# Altium schematic sheet DC_MTR_DVR_SCHEM.SchDoc: DUAL DC MOTOR DRIVER
size A4; Date: 01/08/2024; Author: R Abhram; SheetNumber: 1; SheetTotal: 1
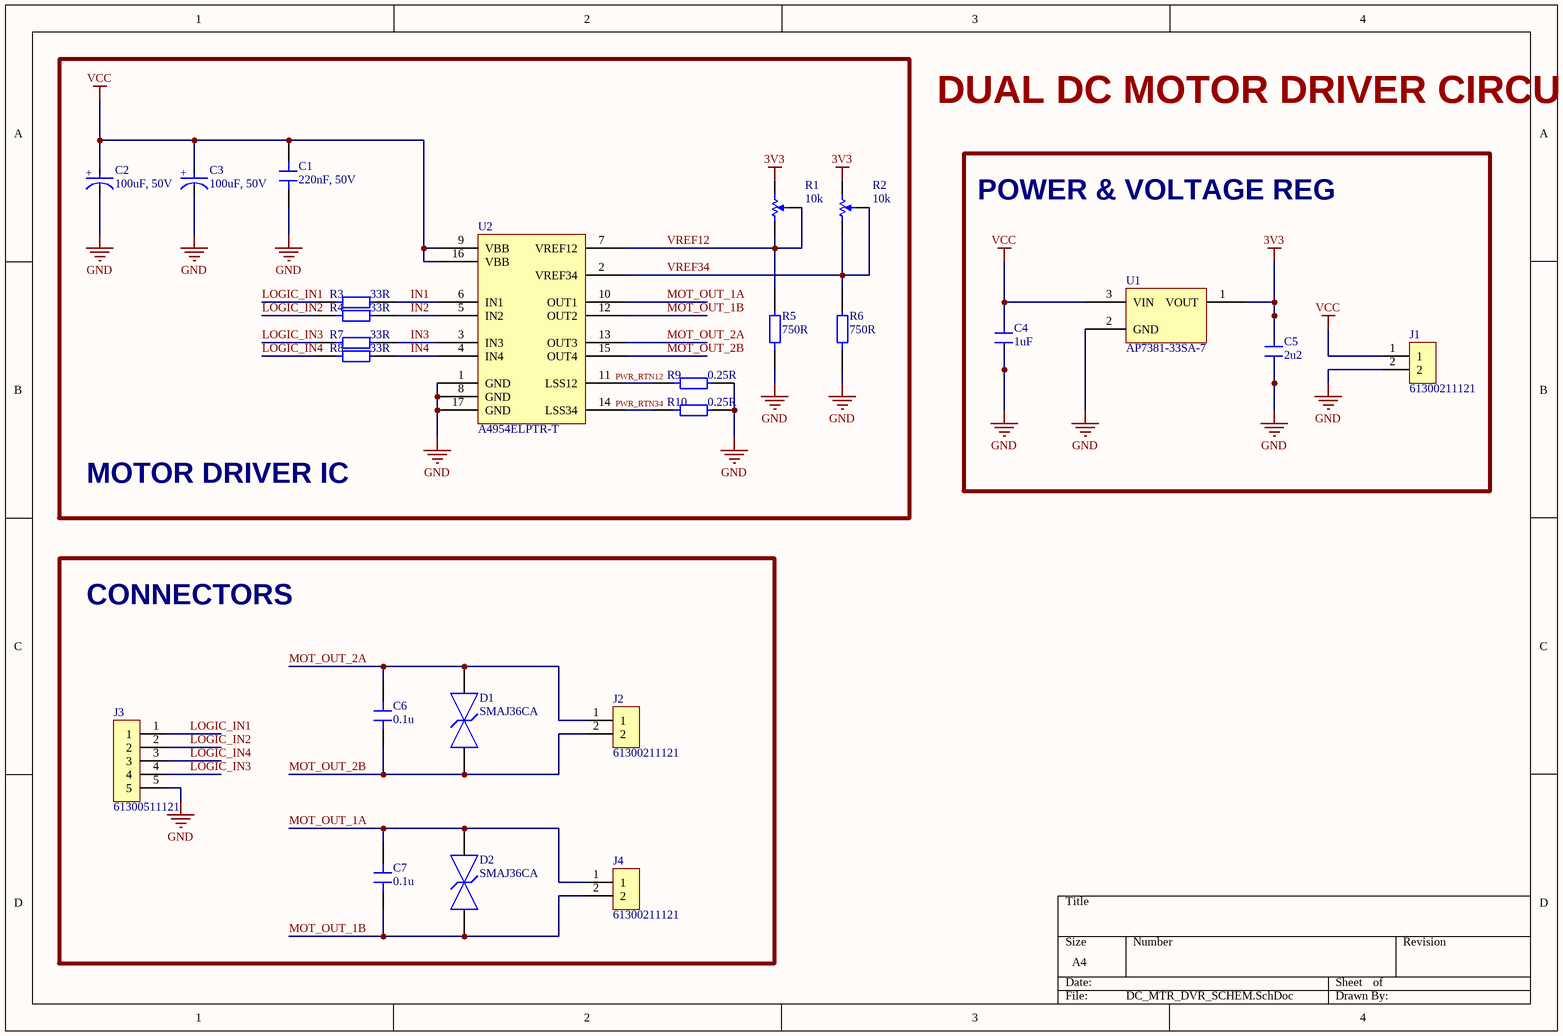
[diagram p0: DC_MTR_DVR_SCHEM.SchDoc]

## Parts
C1  220nF, 50V  [FP-0402-L_1_0_0_05-W_0_5-IPC_A]
C2  100uF, 50V  [100U_50V_ELECTROLYTIC_CAP]
C3  100uF, 50V  [100U_50V_ELECTROLYTIC_CAP]
C4  1uF  [1U_0402_CER_CAP_35V]
C5  2u2  [2_2U_0402_CER_CAP]
C6  0.1u  [1U_0402_CER_CAP_35V]
C7  0.1u  [1U_0402_CER_CAP_35V]
D1  SMAJ36CA  [TVS_DIODE]
D2  SMAJ36CA  [TVS_DIODE]
J1  61300211121  [2_POS_HEADER_2_54]
J2  61300211121  [2_POS_HEADER_2_54]
J3  61300511121  [5_POS_HEADER_2_54]
J4  61300211121  [2_POS_HEADER_2_54]
R1  10k  [10K_TRIM_POT]
R2  10k  [10K_TRIM_POT]
R3  33R  [33_0402_RES]
R4  33R  [33_0402_RES]
R5  750R  [750_0402_RES]
R6  750R  [750_0402_RES]
R7  33R  [33_0402_RES]
R8  33R  [33_0402_RES]
R9  0.25R  [0_25_RESISTOR]
R10  0.25R  [0_25_RESISTOR]
U1  AP7381-33SA-7  [DIODES INC SOT-89 LINEAR REG]
U2  A4954ELPTR-T  [ALLEGRO TSSOP-16EP LP]

## Blocks framed on the sheet
MOTOR DRIVER IC: C1-C3 R1-R10 U2
POWER & VOLTAGE REG: C4 C5 J1 U1
CONNECTORS: C6 C7 D1 D2 J2-J4

## Nets
3V3: C5.2 R1.3 R2.3 U1.1(VOUT)
GND: C1.1 C2.1(C) C3.1(C) C4.1 C5.1 J1.2 J3.5 R5.1 R6.1 R9.2 R10.2 U1.2(GND) U2.1(GND) U2.8(GND) U2.17(GND)
VCC: C1.2 C2.2(A) C3.2(A) C4.2 J1.1 U1.3(VIN) U2.9(VBB) U2.16(VBB)
IN1: R3.2 U2.6(IN1)
IN2: R4.2 U2.5(IN2)
IN3: R7.2 U2.3(IN3)
IN4: R8.2 U2.4(IN4)
LOGIC_IN1: J3.1 R3.1
LOGIC_IN2: J3.2 R4.1
LOGIC_IN3: J3.4 R7.1
LOGIC_IN4: J3.3 R8.1
MOT_OUT_1A: C7.2 D2.2 J4.1 U2.10(OUT1)
MOT_OUT_1B: C7.1 D2.1 J4.2 U2.12(OUT2)
MOT_OUT_2A: C6.2 D1.2 J2.1 U2.13(OUT3)
MOT_OUT_2B: C6.1 D1.1 J2.2 U2.15(OUT4)
PWR_RTN12: R9.1 U2.11(LSS12)
PWR_RTN34: R10.1 U2.14(LSS34)
VREF12: R1.1 R1.2 R5.2 U2.7(VREF12)
VREF34: R2.1 R2.2 R6.2 U2.2(VREF34)

## Notes on the sheet
- DUAL DC MOTOR DRIVER CIRCUIT
- (in symbol UWT1H101MNL1GS) +

## Library data of the parts
C1 = UMK105BJ224KV-F: CAP CER 0.22UF 50V X5R 0402; Manufacturer: Taiyo Yuden; Material: 4241ConductorMaterial; Tolerance: 10%; Supplier: Avnet; Supplier Part Number: UMK105BJ224KV-F; Manufacturer Part Number: UMK105BJ224KV-F; RoHS: Yes; Category: Ceramic Capacitors; Stock: 170000; Pricing: 10000=0.03115, 20000=0.03045, 40000=0.02905, 60000=0.02398, 80000=0.02338 (USD); Mounting Technology: Surface Mount; Case/Package: 0402; Case Code (Metric): 1005; Case Code (Imperial): 0402; Min Operating Temperature: -55°C; Max Operating Temperature: 85°C; Package Quantity: 1; Packaging: Tape and Reel; Value: 220nF; Voltage Rating: 50V; Voltage Rating (DC): 50V; Dielectric: X5R; Termination: SMD/SMT; Series: M; Length: 0.039inch; Width: 0.02inch; Height: 0.5mm; Thickness: 0.022inch; RoHS Compliant: Yes; Halogen Free: 5694HalogenFree; Lead Free: 5697LeadFree; ComponentLink1URL: https://datasheet.ciiva.com/24495/460umk105bj224kv-f-24495779.pdf?src-supplier=Onlinecomponents.com; ComponentLink1Description: https://datasheet.ciiva.com/24495/460umk105bj224kv-f-24495779.pdf?src-supplier=Onlinecomponents.com; ComponentLink2URL: https://datasheet.ciiva.com/30112/713umk105bj224kv-f-30112478.pdf?src-supplier=Onlinecomponents.com; ComponentLink2Description: https://datasheet.ciiva.com/30112/713umk105bj224kv-f-30112478.pdf?src-supplier=Onlinecomponents.com; ComponentLink3URL: https://datasheet.ciiva.com/18697/mlcc-all-e-18697509.pdf?src-supplier=Digikey; ComponentLink3Description: https://datasheet.ciiva.com/18697/mlcc-all-e-18697509.pdf?src-supplier=Digikey; LCSC Part No.: C268018
C2 C3 = UWT1H101MNL1GS: CAP ALUM 100UF 20% 50V SMD; Manufacturer: Nichicon; Dielectric Material: 158ConductorMaterial; Polarity: 5066Direction; Supplier: Rs; Supplier Part Number: 7392870P; Manufacturer Part Number: UWT1H101MNL1GS; RoHS: Yes; Category: Aluminum Electrolytic Capacitors; Stock: 280; Pricing: 250=0.114, 1000=0.111 (GBP); Lead Free: 5697LeadFree; ComponentLink1URL: https://datasheet.ciiva.com/11776/0900766b80fa3a91-11776930.pdf?src-supplier=Rs; ComponentLink1Description: https://datasheet.ciiva.com/11776/0900766b80fa3a91-11776930.pdf?src-supplier=Rs; ComponentLink2URL: https://datasheet.ciiva.com/97/e-wt-97104.pdf?src-supplier=Digikey; ComponentLink2Description: https://datasheet.ciiva.com/97/e-wt-97104.pdf?src-supplier=Digikey; ComponentLink3URL: https://datasheet.ciiva.com/97/e-wt-97105.pdf?src-supplier=Digikey; ComponentLink3Description: https://datasheet.ciiva.com/97/e-wt-97105.pdf?src-supplier=Digikey; ComponentLink4URL: https://datasheet.ciiva.com/97/e-wt-97106.pdf?src-supplier=Digikey; ComponentLink4Description: https://datasheet.ciiva.com/97/e-wt-97106.pdf?src-supplier=Digikey; ComponentLink5URL: https://datasheet.ciiva.com/5362/e-wt-30307-5362773.pdf?src-supplier=Mouser; ComponentLink5Description: https://datasheet.ciiva.com/5362/e-wt-30307-5362773.pdf?src-supplier=Mouser; ComponentLink6URL: https://datasheet.ciiva.com/28458/1910938-28458459.pdf?src-supplier=Element14; ComponentLink6Description: https://datasheet.ciiva.com/28458/1910938-28458459.pdf?src-supplier=Element14; ComponentLink7URL: https://datasheet.ciiva.com/7781/e-wt-7781807.pdf?src-supplier=Element14; ComponentLink7Description: https://datasheet.ciiva.com/7781/e-wt-7781807.pdf?src-supplier=Element14; ComponentLink8URL: https://datasheet.ciiva.com/11686/e-wt-11686889.pdf?src-supplier=Avnet; ComponentLink8Description: https://datasheet.ciiva.com/11686/e-wt-11686889.pdf?src-supplier=Avnet; ComponentLink9URL: https://datasheet.ciiva.com/16502/e-wt-16502940.pdf?src-supplier=Future+Electronics; ComponentLink9Description: https://datasheet.ciiva.com/16502/e-wt-16502940.pdf?src-supplier=Future+Electronics; LCSC Part No.: C445063
C4 = C1005X5R1V105K050BC: 1 µF ±10% 35V Ceramic Capacitor X5R 0402 (1005 Metric); Manufacturer: TDK; Material: 4241ConductorMaterial; Supplier: Digikey; Supplier Part Number: 445-9073-1-ND; Manufacturer Part Number: C1005X5R1V105K050BC; RoHS: Yes; Category: Ceramic Capacitors; Stock: 841637; Pricing: 1=0.18, 10=0.122, 50=0.0728, 100=0.0573, 500=0.04234, 1000=0.03506, 2500=0.03263, 5000=0.02985 (USD); Mounting Technology: Surface Mount; Case/Package: 0402; Case Code (Metric): 1005; Case Code (Imperial): 0402; Dielectric Material: Ceramic; Min Operating Temperature: -55°C; Max Operating Temperature: 85°C; Tolerance: 10%; Value: 1uF; Voltage Rating: 35V; Packaging: Tape and Reel; Series: C; Dielectric: X5R; Length: 1mm; Depth: 0.5mm; Radiation Hardening: No; Reach SVHC Compliant: No; Lead Free: Lead Free; RoHS Compliant: Yes; ComponentLink1URL: https://datasheet.ciiva.com/26834/getdatasheetpartid-750449-26834298.pdf?src-supplier=Verical; ComponentLink1Description: https://datasheet.ciiva.com/26834/getdatasheetpartid-750449-26834298.pdf?src-supplier=Verical; ComponentLink2URL: https://datasheet.ciiva.com/28451/1796654-28451087.pdf?src-supplier=Element14; ComponentLink2Description: https://datasheet.ciiva.com/28451/1796654-28451087.pdf?src-supplier=Element14; ComponentLink3URL: https://datasheet.ciiva.com/22719/1796654-22719533.pdf?src-supplier=Element14; ComponentLink3Description: https://datasheet.ciiva.com/22719/1796654-22719533.pdf?src-supplier=Element14; LCSC Part No.: C5331012
C5 = GRM188R6YA225KA12D: CAP CER 2.2UF 35V X5R 0603; Manufacturer: Murata; Supplier: Digikey; Supplier Part Number: 490-7204-1-ND; Manufacturer Part Number: GRM188R6YA225KA12D; RoHS: Yes; Category: Ceramic Capacitors; Stock: 373912; Pricing: 1=0.19, 10=0.131, 50=0.0786, 100=0.0618, 500=0.04562, 1000=0.03776 (USD); Lead Free: 5697LeadFree; ComponentLink1URL: https://datasheet.ciiva.com/14906/partnumbering-e-01-14906490.pdf?src-supplier=Digikey; ComponentLink1Description: https://datasheet.ciiva.com/14906/partnumbering-e-01-14906490.pdf?src-supplier=Digikey; ComponentLink2URL: https://datasheet.ciiva.com/14906/partnumbering-e-01-14906491.pdf?src-supplier=Digikey; ComponentLink2Description: https://datasheet.ciiva.com/14906/partnumbering-e-01-14906491.pdf?src-supplier=Digikey; ComponentLink3URL: https://datasheet.ciiva.com/14906/partnumbering-e-01-14906492.pdf?src-supplier=Digikey; ComponentLink3Description: https://datasheet.ciiva.com/14906/partnumbering-e-01-14906492.pdf?src-supplier=Digikey; LCSC Part No.: C86017
C6 C7 = GMK105BJ104KV-F: CAP CER 0.1UF 35V X5R 0402; Manufacturer: Taiyo Yuden; Material: 4241ConductorMaterial; Supplier: Digikey; Supplier Part Number: 587-1994-6-ND; Manufacturer Part Number: GMK105BJ104KV-F; RoHS: Yes; Category: Ceramic Capacitors; Stock: 1172174; Pricing: 1=0.13, 10=0.089, 50=0.053, 100=0.0417, 500=0.0308, 1000=0.0255, 2500=0.02374, 5000=0.02172 (USD); Halogen Free: 5694HalogenFree; ComponentLink1URL: https://datasheet.ciiva.com/30194/200gmk105bj104kv-f-30194761.pdf?src-supplier=Onlinecomponents.com; ComponentLink1Description: https://datasheet.ciiva.com/30194/200gmk105bj104kv-f-30194761.pdf?src-supplier=Onlinecomponents.com; ComponentLink2URL: https://datasheet.ciiva.com/11464/gmk105bj104kv-f-ss-11464131.pdf?src-supplier=Avnet; ComponentLink2Description: https://datasheet.ciiva.com/11464/gmk105bj104kv-f-ss-11464131.pdf?src-supplier=Avnet; ComponentLink3URL: https://datasheet.ciiva.com/30104/147gmk105bj104kv-f-30104963.pdf?src-supplier=Onlinecomponents.com; ComponentLink3Description: https://datasheet.ciiva.com/30104/147gmk105bj104kv-f-30104963.pdf?src-supplier=Onlinecomponents.com; ComponentLink4URL: https://datasheet.ciiva.com/15920/1013gmk105bj104kv-f-15920676.pdf?src-supplier=Onlinecomponents.com; ComponentLink4Description: https://datasheet.ciiva.com/15920/1013gmk105bj104kv-f-15920676.pdf?src-supplier=Onlinecomponents.com; ComponentLink5URL: https://datasheet.ciiva.com/5412/mlcc-all-e-541559-5412764.pdf?src-supplier=Mouser; ComponentLink5Description: https://datasheet.ciiva.com/5412/mlcc-all-e-541559-5412764.pdf?src-supplier=Mouser; ComponentLink6URL: https://datasheet.ciiva.com/7657/1497285-7657325.pdf?src-supplier=Element14; ComponentLink6Description: https://datasheet.ciiva.com/7657/1497285-7657325.pdf?src-supplier=Element14; ComponentLink7URL: https://datasheet.ciiva.com/22694/1497285-22694245.pdf?src-supplier=Element14; ComponentLink7Description: https://datasheet.ciiva.com/22694/1497285-22694245.pdf?src-supplier=Element14; LCSC Part No.: C187828
D1 D2 = SMAJ36CA: TVS DIODE 36VWM 58.1VC DO214AC; Manufacturer: Littelfuse; Direction: Bidirectional; Max Surge Current: 6.9A; Reverse Standoff Voltage: 36V; Min Breakdown Voltage: 40V; Clamping Voltage: 58.1V; Peak Pulse Power: 400W; Test Current: 1mA; Max Reverse Leakage Current: 1uA; Number of Channels: 1; Max Power Dissipation: 3.3W; Max Breakdown Voltage: 44.2V; Power Line Protection: No; Diode Type: ZENER; Supplier: Digikey; Supplier Part Number: SMAJ36CALFCT-ND; Manufacturer Part Number: SMAJ36CA; RoHS: Yes; Category: TVS Diodes; Stock: 54488; Pricing: 1=0.4, 10=0.287, 100=0.1449, 500=0.12844, 1000=0.09996, 2000=0.08947 (USD); Mounting Technology: Surface Mount; Case/Package: DO-214AC; Pins: 2; Min Operating Temperature: -65°C; Max Operating Temperature: 150°C; Packaging: Tape and Reel; Package Quantity: 5000; Breakdown Voltage: 40V; Polarity: Bidirectional; Peak Pulse Current: 6.9A; Operating Supply Voltage: 36V; Reverse Breakdown Voltage: 40V; Number of Bidirectional Channels: 1; Termination: SMD/SMT; Number of Elements: 1; Power Dissipation: 400W; Leakage Current: 1uA; Series: SMAJ; Voltage Rating (DC): 36V; Clamping Voltage-Max: 58.1V; Reverse Voltage: 36V; Length: 5.28mm; Width: 2.79mm; Height: 2.29mm; RoHS Compliant: Yes; Reach SVHC Compliant: No; Lead Free: Lead Free; ComponentLink1URL: https://datasheet.ciiva.com/16487/littelfuse-tvs-diode-smaj-16487439.pdf?src-supplier=Future+Electronics; ComponentLink1Description: https://datasheet.ciiva.com/16487/littelfuse-tvs-diode-smaj-16487439.pdf?src-supplier=Future+Electronics; ComponentLink2URL: https://datasheet.ciiva.com/331/littelfuse-tvs-diode-smaj-datasheet-pdf-331061.pdf?src-supplier=Digikey; ComponentLink2Description: https://datasheet.ciiva.com/331/littelfuse-tvs-diode-smaj-datasheet-pdf-331061.pdf?src-supplier=Digikey; ComponentLink3URL: https://datasheet.ciiva.com/331/littelfuse-tvs-diode-smaj-datasheet-pdf-331062.pdf?src-supplier=Digikey; ComponentLink3Description: https://datasheet.ciiva.com/331/littelfuse-tvs-diode-smaj-datasheet-pdf-331062.pdf?src-supplier=Digikey; ComponentLink4URL: https://datasheet.ciiva.com/331/littelfuse-tvs-diode-smaj-datasheet-pdf-331060.pdf?src-supplier=Digikey; ComponentLink4Description: https://datasheet.ciiva.com/331/littelfuse-tvs-diode-smaj-datasheet-pdf-331060.pdf?src-supplier=Digikey; LCSC Part No.: C908830
J1 J2 J4 = 61300211121: CONN HEADER VERT 2POS 2.54MM; Manufacturer: Wurth Electronics; Current Rating: 3A; Voltage Rating: 250V; Number of Positions: 2; Contact Resistance: 20mR; Gender: 29Gender; Pitch: 0.1inch; Supplier: Rs; Supplier Part Number: 8281581; Manufacturer Part Number: 61300211121; RoHS: Yes; Category: Headers and Wire Housings; Stock: 865; Pricing: 5=0.11, 50=0.076, 100=0.062, 200=0.058, 500=0.052 (GBP); Mounting Technology: Through Hole; Contact Plating: Gold; Housing Material: PBT; Contact Material: Copper Alloy,Copper; Color: Black; Min Operating Temperature: -40°C; Max Operating Temperature: 125°C; Number of Rows: 1; Contact Gender: Male; Packaging: Bulk; Termination: Through Hole; Number of Contacts: 2; Series: WR-PHD; Contact Type: Male Pin; Operating Supply Voltage: 250V; Orientation: 5495OrientationType; Height: 8.94mm; Contact Mating Length: 0.236inch; RoHS Compliant: Yes; Reach SVHC Compliant: Unknown; Lead Free: 5697LeadFree; ComponentLink1URL: https://datasheet.ciiva.com/13619/6130xx11121-48870-13619345.pdf?src-supplier=Mouser; ComponentLink1Description: https://datasheet.ciiva.com/13619/6130xx11121-48870-13619345.pdf?src-supplier=Mouser; LCSC Part No.: N/A
J3 = 61300511121: CONN HEADER VERT 5POS 2.54MM; Manufacturer: Wurth Electronics; Number of Positions: 5; Gender: Male; Contact Resistance: 20mR; Current Rating: 3A; Operating Supply Voltage: 250V; Pitch: 0.1inch; Supplier: Rs; Supplier Part Number: 8281597; Manufacturer Part Number: 61300511121; RoHS: Yes; Category: Headers and Wire Housings; Stock: 415; Pricing: 5=0.218, 125=0.118, 500=0.1, 2500=0.094, 5000=0.088 (GBP); Mounting Technology: Through Hole; Contact Plating: Gold; Contact Material: Copper; Color: Black; Min Operating Temperature: -40°C; Max Operating Temperature: 105°C; Number of Rows: 1; Packaging: Bulk; Termination: Solder; Number of Contacts: 5; Series: WR-PHD; Contact Type: Male Pin; Orientation: 5495OrientationType; Voltage Rating: 250V; Height: 8.89mm; Contact Mating Length: 0.236inch; Lead Free: Lead Free; RoHS Compliant: Yes; Reach SVHC Compliant: Unknown; ComponentLink1URL: http://www.farnell.com/cad/1737268.pdf?src-supplier=Element14; ComponentLink1Description: http://www.farnell.com/cad/1737268.pdf?src-supplier=Element14; ComponentLink2URL: https://datasheet.octopart.com/61300511121-W%C3%BCrth-Elektronik-datasheet-21154836.pdf?src-supplier=Element14; ComponentLink2Description: https://datasheet.octopart.com/61300511121-W%C3%BCrth-Elektronik-datasheet-21154836.pdf?src-supplier=Element14; ComponentLink3URL: https://katalog.we-online.de/em/datasheet/6130xx11121.pdf?src-supplier=Digikey; ComponentLink3Description: https://katalog.we-online.de/em/datasheet/6130xx11121.pdf?src-supplier=Digikey; LCSC Part No.: N/A
R1 R2 = TC33X-2-103E: TRIMMER 10K OHM 0.15W J LEAD TOP; Manufacturer: Bourns; Tolerance: 25%; Value: 10kR; Number of Turns: 1; Power Rating: 100mW; Temperature Coefficient: 250ppm/°C; Voltage Rating (DC): 50V; Supplier: Rs; Supplier Part Number: 4617135P; Manufacturer Part Number: TC33X-2-103E; RoHS: Yes; Category: Variable Resistors and Potentiometers; Stock: 53000; Pricing: 500=0.175, 1000=0.158, 2000=0.141, 4000=0.124 (GBP); Mounting Technology: Surface Mount; Color: Silver; Weight: 29.4mg; Min Operating Temperature: -40°C; Max Operating Temperature: 100°C; Packaging: Tape and Reel; Package Quantity: 1; Resistor Type: Cermet; Termination: Foot Print; Taper: Linear; Max Power Dissipation: 100mW; Series: TC33; Resistance Tolerance: 25%; Length: 3mm; Width: 0.118inch; Height: 0.047inch; Depth: 3.8mm; Radiation Hardening: No; Reach SVHC Compliant: No; Military Standard: Not; Lead Free: Lead Free; RoHS Compliant: Yes; ComponentLink1URL: https://datasheet.ciiva.com/11830/0900766b802749b3-11830705.pdf?src-supplier=Rs; ComponentLink1Description: https://datasheet.ciiva.com/11830/0900766b802749b3-11830705.pdf?src-supplier=Rs; ComponentLink2URL: https://datasheet.ciiva.com/7953/1818686-7953349.pdf?src-supplier=Element14; ComponentLink2Description: https://datasheet.ciiva.com/7953/1818686-7953349.pdf?src-supplier=Element14; ComponentLink3URL: https://datasheet.ciiva.com/28659/1520225-28659212.pdf?src-supplier=Element14; ComponentLink3Description: https://datasheet.ciiva.com/28659/1520225-28659212.pdf?src-supplier=Element14; ComponentLink4URL: https://datasheet.ciiva.com/2155/tc33-2155963.pdf?src-supplier=Digikey; ComponentLink4Description: https://datasheet.ciiva.com/2155/tc33-2155963.pdf?src-supplier=Digikey; ComponentLink5URL: https://datasheet.ciiva.com/2155/tc33-2155964.pdf?src-supplier=Digikey; ComponentLink5Description: https://datasheet.ciiva.com/2155/tc33-2155964.pdf?src-supplier=Digikey; ComponentLink6URL: https://datasheet.ciiva.com/2155/tc33-2155962.pdf?src-supplier=Digikey; ComponentLink6Description: https://datasheet.ciiva.com/2155/tc33-2155962.pdf?src-supplier=Digikey; ComponentLink7URL: https://datasheet.ciiva.com/8089/tc33-8089484.pdf?src-supplier=Avnet; ComponentLink7Description: https://datasheet.ciiva.com/8089/tc33-8089484.pdf?src-supplier=Avnet; ComponentLink8URL: https://datasheet.ciiva.com/26944/getdatasheetpartid-183773-26944166.pdf?src-supplier=Verical; ComponentLink8Description: https://datasheet.ciiva.com/26944/getdatasheetpartid-183773-26944166.pdf?src-supplier=Verical; LCSC Part No.: C719176
R3 R4 R7 R8 = RC0402FR-0733RL: RES 33 OHM 1% 1/16W 0402; Manufacturer: Yageo; Power Rating: 62.5mW; Voltage Rating: 50V; Temperature Coefficient: 100ppm/°C; Max Power Dissipation: 63mW; Supplier: Digikey; Supplier Part Number: 311-33.0LRCT-ND; Manufacturer Part Number: RC0402FR-0733RL; RoHS: Yes; Category: Chip SMD Resistors; Stock: 10660929; Pricing: 1=0.1, 10=0.015, 50=0.0088, 100=0.0073, 500=0.00488, 1000=0.00417, 5000=0.00297 (USD); Case/Package: 0402; Pins: 2; Case Code (Imperial): 0402; Case Code (Metric): 1005; Min Operating Temperature: -55°C; Max Operating Temperature: 155°C; Resistor Type: Thick Film; Value: 33R; Tolerance: 1%; Packaging: Tape and Reel; Voltage Rating (DC): 50V; Package Quantity: 10000; Termination: SMD/SMT; Features: Moisture Resistant; Series: RC; Number of Terminations: 2; Resistance Tolerance: 1%; Construction: Rectangular; Technology: THICK FILM; Voltage Rating (AC): 50V; Length: 1mm; Width: 0.5mm; Height: 0.35mm; Depth: 0.5mm; RoHS Compliant: Yes; Military Standard: Not; Lead Free: Lead Free; Reach SVHC Compliant: Unknown; ComponentLink1URL: https://datasheet.ciiva.com/11819/0900766b80c66297-11819487.pdf?src-supplier=Rs; ComponentLink1Description: https://datasheet.ciiva.com/11819/0900766b80c66297-11819487.pdf?src-supplier=Rs; ComponentLink2URL: https://datasheet.ciiva.com/24070/pyu-rc0402-51-rohs-l-6-r-8721-24070077.pdf?src-supplier=Mouser; ComponentLink2Description: https://datasheet.ciiva.com/24070/pyu-rc0402-51-rohs-l-6-r-8721-24070077.pdf?src-supplier=Mouser; ComponentLink3URL: https://datasheet.ciiva.com/7849/1018594-7849967.pdf?src-supplier=Element14; ComponentLink3Description: https://datasheet.ciiva.com/7849/1018594-7849967.pdf?src-supplier=Element14; ComponentLink4URL: https://datasheet.ciiva.com/7849/1018594-7849966.pdf?src-supplier=Element14; ComponentLink4Description: https://datasheet.ciiva.com/7849/1018594-7849966.pdf?src-supplier=Element14; ComponentLink5URL: https://datasheet.ciiva.com/15189/getdatasheetpartid-329253-15189431.pdf?src-supplier=Verical; ComponentLink5Description: https://datasheet.ciiva.com/15189/getdatasheetpartid-329253-15189431.pdf?src-supplier=Verical; ComponentLink6URL: https://datasheet.ciiva.com/17070/pyu-rc0402-51-rohs-l-6-r-17070335.pdf?src-supplier=Future+Electronics; ComponentLink6Description: https://datasheet.ciiva.com/17070/pyu-rc0402-51-rohs-l-6-r-17070335.pdf?src-supplier=Future+Electronics; LCSC Part No.: C138002
R5 R6 = RC0402JR-07750RL: RES 750 OHM 5% 1/16W 0402; Manufacturer: Yageo; Supplier: Future Electronics; Supplier Part Number: 7253206; Manufacturer Part Number: RC0402JR-07750RL; RoHS: Yes; Category: Chip SMD Resistors; Stock: 20000; Pricing: 10000=0.0008, 100000=0.0007, 300000=0.0007, 750000=0.0007, 2000000=0.0006 (USD); ComponentLink1URL: https://datasheet.ciiva.com/12575/pyu-rc0402-51-rohs-l-6-r-8721-12575790.pdf?src-supplier=Mouser; ComponentLink1Description: https://datasheet.ciiva.com/12575/pyu-rc0402-51-rohs-l-6-r-8721-12575790.pdf?src-supplier=Mouser; ComponentLink2URL: https://datasheet.ciiva.com/8884/pyu-rc0402-51-rohs-l-6-8884858.pdf?src-supplier=Avnet; ComponentLink2Description: https://datasheet.ciiva.com/8884/pyu-rc0402-51-rohs-l-6-8884858.pdf?src-supplier=Avnet; ComponentLink3URL: https://datasheet.ciiva.com/16744/pyu-rc0402-51-rohs-l-6-r-16744186.pdf?src-supplier=Future+Electronics; ComponentLink3Description: https://datasheet.ciiva.com/16744/pyu-rc0402-51-rohs-l-6-r-16744186.pdf?src-supplier=Future+Electronics; LCSC Part No.: C137842
R9 R10 = CSR1206FKR250: RES 0.25 OHM 1% 1/2W 1206; Manufacturer: Stackpole Electronics; Supplier: Digikey; Supplier Part Number: CSR1206FKR250CT-ND; Manufacturer Part Number: CSR1206FKR250; RoHS: Yes; Category: Chip SMD Resistors; Stock: 83913; Pricing: 1=0.41, 10=0.298, 25=0.2388, 50=0.1772, 100=0.125, 250=0.11136, 500=0.09544 (USD); Lead Free: 5697LeadFree; ComponentLink1URL: https://www.seielect.com/catalog/SEI-Packaging.pdf?src-supplier=Digikey; ComponentLink1Description: https://www.seielect.com/catalog/SEI-Packaging.pdf?src-supplier=Digikey; ComponentLink2URL: https://datasheet.octopart.com/CSR1206FKR250-Stackpole-Electronics-datasheet-141193797.pdf?src-supplier=LKR; ComponentLink2Description: https://datasheet.octopart.com/CSR1206FKR250-Stackpole-Electronics-datasheet-141193797.pdf?src-supplier=LKR; LCSC Part No.: C346771
U1 = AP7381-33SA-7: IC MOTOR DRIVER 8V-40V 16TSSOP; Manufacturer: Diodes; Number of Channels: 1NUMBER; Output Voltage: 3.3V; Supplier: Digikey; Supplier Part Number: 31-AP7381-33SA-7CT-ND; Manufacturer Part Number: AP7381-33SA-7; RoHS: Yes; Stock: 40; Pricing: 1=0.62, 10=0.37, 25=0.3044, 100=0.23, 250=0.19328, 500=0.17066, 1000=0.15167 (USD); ComponentLink1URL: https://datasheet.octopart.com/AP7381-33SA-7-Diodes-Inc.-datasheet-166296600.pdf?src-supplier=Future+Electronics; ComponentLink1Description: https://datasheet.octopart.com/AP7381-33SA-7-Diodes-Inc.-datasheet-166296600.pdf?src-supplier=Future+Electronics; ComponentLink2URL: https://datasheet.octopart.com/AP7381-33SA-7-Diodes-Inc.-datasheet-141402627.pdf?src-supplier=Farnell; ComponentLink2Description: https://datasheet.octopart.com/AP7381-33SA-7-Diodes-Inc.-datasheet-141402627.pdf?src-supplier=Farnell; LCSC Part No.: C3752764
U2 = A4954ELPTR-T: IC MOTOR DRIVER 8V-40V 16TSSOP; Manufacturer: Allegro MicroSystems; Supplier: Digikey; Supplier Part Number: 620-1384-1-ND; Manufacturer Part Number: A4954ELPTR-T; RoHS: Yes; Category: Motor Drivers; Stock: 21903; Pricing: 1=2.78, 10=2.5, 25=2.3632, 100=2.0483, 250=1.94324, 500=1.74366, 1000=1.47056 (USD); ComponentLink1URL: https://datasheet.ciiva.com/8199/a4954-datasheet-8199653.pdf?src-supplier=Avnet; ComponentLink1Description: https://datasheet.ciiva.com/8199/a4954-datasheet-8199653.pdf?src-supplier=Avnet; LCSC Part No.: C2688265